# Altium project Power_Box_V0.PrjPcb (part 2 of 2)
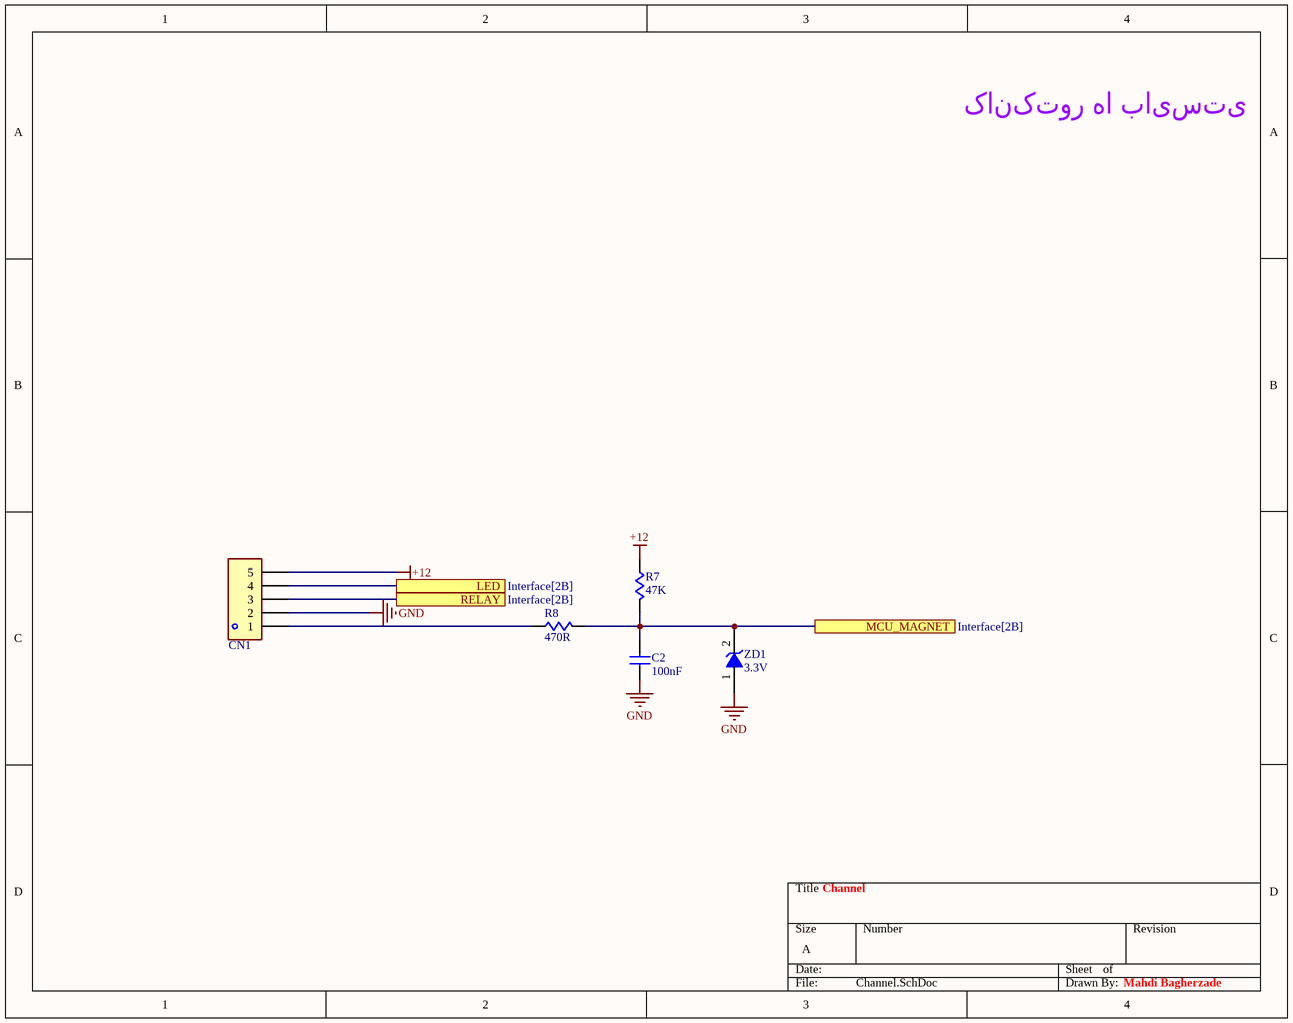
[diagram p10: Channel.SchDoc]

## Nets that join several sheets
+3V3: STM32_AUX (6 pins), LCD TFT 40 Pin (FB4.1 TP2.1), EEPROM (FB2.2), KEY1 (R1_1.1), KEY2 (R1_2.1), KEY3 (R1_3.1)
+5: Interface (C48.1 C49.1 CN7.3), STM32_AUX (C36.1 C37.1 U5.3), ISD1730 (FB3.1), Power (C43.1 C45.1 LED4.1 U6.3)
+12: Power (C42.1 C44.1 D4.2 U6.1), ULN2003_1 (FB6_1.1), CHANNEL1 (CN1_1.5 R7_1.1), CHANNEL2 (CN1_2.5 R7_2.1), CHANNEL3 (CN1_3.5 R7_3.1), CHANNEL4 (CN1_4.5 R7_4.1), CHANNEL5 (CN1_5.5 R7_5.1), CHANNEL6 (CN1_6.5 R7_6.1), CHANNEL7 (CN1_7.5 R7_7.1), CHANNEL8 (CN1_8.5 R7_8.1), CHANNEL9 (CN1_9.5 R7_9.1), CHANNEL10 (CN1_10.5 R7_10.1), CHANNEL11 (CN1_11.5 R7_11.1), CHANNEL12 (CN1_12.5 R7_12.1), CHANNEL13 (CN1_13.5 R7_13.1), CHANNEL14 (CN1_14.5 R7_14.1), CHANNEL15 (CN1_15.5 R7_15.1), CHANNEL16 (CN1_16.5 R7_16.1), CHANNEL17 (CN1_17.5 R7_17.1), CHANNEL18 (CN1_18.5 R7_18.1), CHANNEL19 (CN1_19.5 R7_19.1), CHANNEL20 (CN1_20.5 R7_20.1), CHANNEL21 (CN1_21.5 R7_21.1), CHANNEL22 (CN1_22.5 R7_22.1), CHANNEL23 (CN1_23.5 R7_23.1), CHANNEL24 (CN1_24.5 R7_24.1), CHANNEL25 (CN1_25.5 R7_25.1), CHANNEL26 (CN1_26.5 R7_26.1), CHANNEL27 (CN1_27.5 R7_27.1), CHANNEL28 (CN1_28.5 R7_28.1), ULN2003_2 (FB6_2.1), ULN2003_3 (FB6_3.1), ULN2003_4 (FB6_4.1), ULN2003_5 (FB6_5.1), ULN2003_6 (FB6_6.1), ULN2003_7 (FB6_7.1), ULN2003_8 (FB6_8.1)
GND: Interface (C46.2), STM32_AUX (NT1.2), Power (7 pins), CHANNEL1 (C2_1.2 CN1_1.2 ZD1_1.1), CHANNEL2 (C2_2.2 CN1_2.2 ZD1_2.1), CHANNEL3 (C2_3.2 CN1_3.2 ZD1_3.1), CHANNEL4 (C2_4.2 CN1_4.2 ZD1_4.1), CHANNEL5 (C2_5.2 CN1_5.2 ZD1_5.1), CHANNEL6 (C2_6.2 CN1_6.2 ZD1_6.1), CHANNEL7 (C2_7.2 CN1_7.2 ZD1_7.1), CHANNEL8 (C2_8.2 CN1_8.2 ZD1_8.1), CHANNEL9 (C2_9.2 CN1_9.2 ZD1_9.1), CHANNEL10 (C2_10.2 CN1_10.2 ZD1_10.1), CHANNEL11 (C2_11.2 CN1_11.2 ZD1_11.1), CHANNEL12 (C2_12.2 CN1_12.2 ZD1_12.1), CHANNEL13 (C2_13.2 CN1_13.2 ZD1_13.1), CHANNEL14 (C2_14.2 CN1_14.2 ZD1_14.1), CHANNEL15 (C2_15.2 CN1_15.2 ZD1_15.1), CHANNEL16 (C2_16.2 CN1_16.2 ZD1_16.1), CHANNEL17 (C2_17.2 CN1_17.2 ZD1_17.1), CHANNEL18 (C2_18.2 CN1_18.2 ZD1_18.1), CHANNEL19 (C2_19.2 CN1_19.2 ZD1_19.1), CHANNEL20 (C2_20.2 CN1_20.2 ZD1_20.1), CHANNEL21 (C2_21.2 CN1_21.2 ZD1_21.1), CHANNEL22 (C2_22.2 CN1_22.2 ZD1_22.1), CHANNEL23 (C2_23.2 CN1_23.2 ZD1_23.1), CHANNEL24 (C2_24.2 CN1_24.2 ZD1_24.1), CHANNEL25 (C2_25.2 CN1_25.2 ZD1_25.1), CHANNEL26 (C2_26.2 CN1_26.2 ZD1_26.1), CHANNEL27 (C2_27.2 CN1_27.2 ZD1_27.1), CHANNEL28 (C2_28.2 CN1_28.2 ZD1_28.1)
GND_MCU: Interface (C48.2 C49.2 CN7.6), MCU (12 pins), STM32_AUX (32 pins), LCD TFT 40 Pin (32 pins), ISD1730 (11 pins), EEPROM (6 pins), KEY1 (C1_1.2 S1_1.1), KEY2 (C1_2.2 S1_2.1), KEY3 (C1_3.2 S1_3.1), ULN2003_1 (C47_1.1 U1_1.8), ULN2003_2 (C47_2.1 U1_2.8), ULN2003_3 (C47_3.1 U1_3.8), ULN2003_4 (C47_4.1 U1_4.8), ULN2003_5 (C47_5.1 U1_5.8), ULN2003_6 (C47_6.1 U1_6.8), ULN2003_7 (C47_7.1 U1_7.8), ULN2003_8 (C47_8.1 U1_8.8)
VCC_MCU: MCU (14 pins), STM32_AUX (18 pins)
ISD_MISO: MCU (U4.75), ISD1730 (U3.4)
ISD_MOSI: MCU (U4.76), ISD1730 (U3.5)
ISD_SCK: MCU (U4.74), ISD1730 (U3.6)
ISD_SS: MCU (U4.73), ISD1730 (U3.7)
LED1: ULN2003_1 (R33_1.1 U1_1.15), CHANNEL1 (CN1_1.4)
LED2: ULN2003_1 (R35_1.1 U1_1.13), CHANNEL2 (CN1_2.4)
LED3: ULN2003_1 (R38_1.1 U1_1.11), CHANNEL3 (CN1_3.4)
LED4: CHANNEL4 (CN1_4.4), ULN2003_2 (R32_2.1 U1_2.16)
LED5: CHANNEL5 (CN1_5.4), ULN2003_2 (R34_2.1 U1_2.14)
LED6: CHANNEL6 (CN1_6.4), ULN2003_2 (R36_2.1 U1_2.12)
LED7: CHANNEL7 (CN1_7.4), ULN2003_2 (R39_2.1 U1_2.10)
LED8: CHANNEL8 (CN1_8.4), ULN2003_3 (R33_3.1 U1_3.15)
LED9: CHANNEL9 (CN1_9.4), ULN2003_3 (R35_3.1 U1_3.13)
LED10: CHANNEL10 (CN1_10.4), ULN2003_3 (R38_3.1 U1_3.11)
LED11: CHANNEL11 (CN1_11.4), ULN2003_4 (R32_4.1 U1_4.16)
LED12: CHANNEL12 (CN1_12.4), ULN2003_4 (R34_4.1 U1_4.14)
LED13: CHANNEL13 (CN1_13.4), ULN2003_4 (R36_4.1 U1_4.12)
LED14: CHANNEL14 (CN1_14.4), ULN2003_4 (R39_4.1 U1_4.10)
LED15: CHANNEL15 (CN1_15.4), ULN2003_5 (R33_5.1 U1_5.15)
LED16: CHANNEL16 (CN1_16.4), ULN2003_5 (R35_5.1 U1_5.13)
LED17: CHANNEL17 (CN1_17.4), ULN2003_5 (R38_5.1 U1_5.11)
LED18: CHANNEL18 (CN1_18.4), ULN2003_6 (R32_6.1 U1_6.16)
LED19: CHANNEL19 (CN1_19.4), ULN2003_6 (R34_6.1 U1_6.14)
LED20: CHANNEL20 (CN1_20.4), ULN2003_6 (R36_6.1 U1_6.12)
LED21: CHANNEL21 (CN1_21.4), ULN2003_6 (R39_6.1 U1_6.10)
LED22: CHANNEL22 (CN1_22.4), ULN2003_7 (R33_7.1 U1_7.15)
LED23: CHANNEL23 (CN1_23.4), ULN2003_7 (R35_7.1 U1_7.13)
LED24: CHANNEL24 (CN1_24.4), ULN2003_7 (R38_7.1 U1_7.11)
LED25: CHANNEL25 (CN1_25.4), ULN2003_8 (R32_8.1 U1_8.16)
LED26: CHANNEL26 (CN1_26.4), ULN2003_8 (R34_8.1 U1_8.14)
LED27: CHANNEL27 (CN1_27.4), ULN2003_8 (R36_8.1 U1_8.12)
LED28: CHANNEL28 (CN1_28.4), ULN2003_8 (R39_8.1 U1_8.10)
MCU_BOOT0: MCU (U4.138), STM32_AUX (H2.2)
MCU_NRST: MCU (U4.25), STM32_AUX (C18.1 R28.1 S2.2)
MCU_OCS_N: MCU (U4.23), STM32_AUX (C19.1 Y2.1)
MCU_OCS_P: MCU (U4.24), STM32_AUX (C20.1 Y2.2)
MCU_RXD: Interface (CN7.4), MCU (U4.102)
MCU_SCL: MCU (U4.136), EEPROM (R11.1 U2.6)
MCU_SDA: MCU (U4.137), EEPROM (R12.1 U2.5)
MCU_SWCLK: MCU (U4.109), STM32_AUX (CN6.3)
MCU_SWDIO: MCU (U4.105), STM32_AUX (CN6.1)
MCU_TXD: Interface (CN7.5), MCU (U4.101)
MCU_VBAT: MCU (U4.6), STM32_AUX (BAT1.1 C3.2 C41.2 D1.2)
RELAY1: ULN2003_1 (R32_1.1 U1_1.16), CHANNEL1 (CN1_1.3)
RELAY2: ULN2003_1 (R34_1.1 U1_1.14), CHANNEL2 (CN1_2.3)
RELAY3: ULN2003_1 (R36_1.1 U1_1.12), CHANNEL3 (CN1_3.3)
RELAY4: ULN2003_1 (R39_1.1 U1_1.10), CHANNEL4 (CN1_4.3)
RELAY5: CHANNEL5 (CN1_5.3), ULN2003_2 (R33_2.1 U1_2.15)
RELAY6: CHANNEL6 (CN1_6.3), ULN2003_2 (R35_2.1 U1_2.13)
RELAY7: CHANNEL7 (CN1_7.3), ULN2003_2 (R38_2.1 U1_2.11)
RELAY8: CHANNEL8 (CN1_8.3), ULN2003_3 (R32_3.1 U1_3.16)
RELAY9: CHANNEL9 (CN1_9.3), ULN2003_3 (R34_3.1 U1_3.14)
RELAY10: CHANNEL10 (CN1_10.3), ULN2003_3 (R36_3.1 U1_3.12)
RELAY11: CHANNEL11 (CN1_11.3), ULN2003_3 (R39_3.1 U1_3.10)
RELAY12: CHANNEL12 (CN1_12.3), ULN2003_4 (R33_4.1 U1_4.15)
RELAY13: CHANNEL13 (CN1_13.3), ULN2003_4 (R35_4.1 U1_4.13)
RELAY14: CHANNEL14 (CN1_14.3), ULN2003_4 (R38_4.1 U1_4.11)
RELAY15: CHANNEL15 (CN1_15.3), ULN2003_5 (R32_5.1 U1_5.16)
RELAY16: CHANNEL16 (CN1_16.3), ULN2003_5 (R34_5.1 U1_5.14)
RELAY17: CHANNEL17 (CN1_17.3), ULN2003_5 (R36_5.1 U1_5.12)
RELAY18: CHANNEL18 (CN1_18.3), ULN2003_5 (R39_5.1 U1_5.10)
RELAY19: CHANNEL19 (CN1_19.3), ULN2003_6 (R33_6.1 U1_6.15)
RELAY20: CHANNEL20 (CN1_20.3), ULN2003_6 (R35_6.1 U1_6.13)
RELAY21: CHANNEL21 (CN1_21.3), ULN2003_6 (R38_6.1 U1_6.11)
RELAY22: CHANNEL22 (CN1_22.3), ULN2003_7 (R32_7.1 U1_7.16)
RELAY23: CHANNEL23 (CN1_23.3), ULN2003_7 (R34_7.1 U1_7.14)
RELAY24: CHANNEL24 (CN1_24.3), ULN2003_7 (R36_7.1 U1_7.12)
RELAY25: CHANNEL25 (CN1_25.3), ULN2003_7 (R39_7.1 U1_7.10)
RELAY26: CHANNEL26 (CN1_26.3), ULN2003_8 (R33_8.1 U1_8.15)
RELAY27: CHANNEL27 (CN1_27.3), ULN2003_8 (R35_8.1 U1_8.13)
RELAY28: CHANNEL28 (CN1_28.3), ULN2003_8 (R38_8.1 U1_8.11)
TFT_BLK: MCU (U4.44), LCD TFT 40 Pin (R24.1 TP9.1)
TFT_CLK: MCU (U4.41), LCD TFT 40 Pin (CN5.10 TP4.1 TP10.1)
TFT_CS: MCU (U4.47), LCD TFT 40 Pin (CN5.9 TP3.1)
TFT_CS_2: MCU (U4.77), LCD TFT 40 Pin (TP13.1)
TFT_CS_3: MCU (U4.78), LCD TFT 40 Pin (TP14.1)
TFT_DC: MCU (U4.46), LCD TFT 40 Pin (CN5.11 TP5.1)
TFT_MISO: MCU (U4.42), LCD TFT 40 Pin (CN5.14 TP7.1 TP12.1)
TFT_MOSI: MCU (U4.43), LCD TFT 40 Pin (CN5.13 TP6.1 TP11.1)
TFT_RES: MCU (U4.45), LCD TFT 40 Pin (CN5.15 TP8.1)
V_CAP_1: MCU (U4.71), STM32_AUX (C35.1)
V_CAP_2: MCU (U4.106), STM32_AUX (C40.1)